# Altium schematic sheet AT24C04M5_TR1_AT24C04M5_TR.schdoc
size 124 x 101 mm
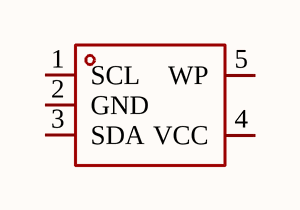
[diagram p0: AT24C04M5_TR1_AT24C04M5_TR.schdoc]

## Parts
U?  AT24C04M5/TR  [SOT-23-5_L2.9-W1.6-P0.95-LS2.8-BR]  (value not drawn)

## Nets

Not connected (* = marked no-connect by the designer): U? 1(SCL) 2(GND) 3(SDA) 4(VCC) 5(WP)

## Library data of the parts
U? = AT24C04M5/TR: Manufacturer: HGSEMI(华冠); Add into BOM: yes; Memory Size: 4Kbit; Symbol: AT24C04M5/TR; Device: AT24C04M5/TR; LCSC Part Name: AT24C04M5/TR; Supplier Part: C7432379; Manufacturer Part: AT24C04M5/TR; Supplier Footprint: SOT-23-5; JLCPCB Part Class: Extended Part; Datasheet: https://atta.szlcsc.com/upload/public/pdf/source/20240521/4DADA01BDF7DE3DFD426DEBDBDEEFDF8.pdf; Supplier: LCSC; Convert to PCB: yes